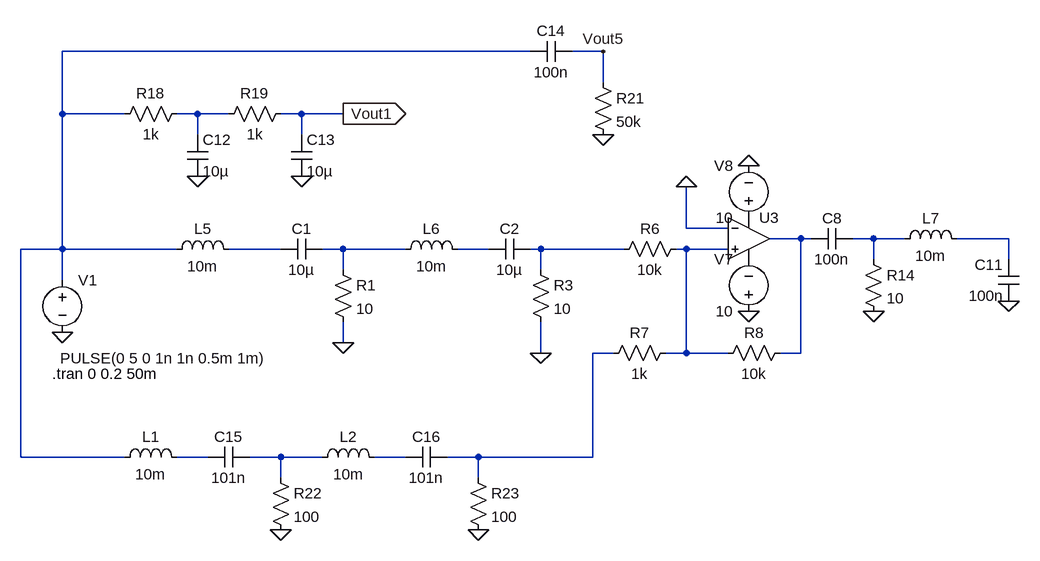
[diagram p0: schematic Project.asc]
Project.asc, the LTspice schematic file:
Version 4
SHEET 1 2452 680
WIRE -416 -272 -1136 -272
WIRE -304 -272 -352 -272
WIRE -304 -224 -304 -272
WIRE -1136 -176 -1136 -272
WIRE -1040 -176 -1136 -176
WIRE -928 -176 -960 -176
WIRE -880 -176 -928 -176
WIRE -768 -176 -800 -176
WIRE -704 -176 -768 -176
WIRE -928 -144 -928 -176
WIRE -768 -144 -768 -176
WIRE -176 0 -176 -64
WIRE -112 0 -176 0
WIRE 0 16 -48 16
WIRE 16 16 0 16
WIRE 112 16 80 16
WIRE 160 16 112 16
WIRE 320 16 240 16
WIRE -1136 32 -1136 -176
WIRE -1136 32 -1200 32
WIRE -960 32 -1136 32
WIRE -800 32 -880 32
WIRE -704 32 -736 32
WIRE -608 32 -704 32
WIRE -480 32 -528 32
WIRE -400 32 -416 32
WIRE -272 32 -400 32
WIRE -176 32 -192 32
WIRE -112 32 -176 32
WIRE 112 48 112 16
WIRE 320 48 320 16
WIRE -704 64 -704 32
WIRE -400 64 -400 32
WIRE -1136 80 -1136 32
WIRE -704 176 -704 144
WIRE -400 192 -400 144
WIRE -288 192 -320 192
WIRE -176 192 -176 32
WIRE -176 192 -208 192
WIRE -112 192 -176 192
WIRE 0 192 0 16
WIRE 0 192 -32 192
WIRE -1200 352 -1200 32
WIRE -1040 352 -1200 352
WIRE -912 352 -960 352
WIRE -800 352 -848 352
WIRE -736 352 -800 352
WIRE -608 352 -656 352
WIRE -496 352 -544 352
WIRE -320 352 -320 192
WIRE -320 352 -496 352
WIRE -800 384 -800 352
WIRE -496 384 -496 352
FLAG -1136 160 0
FLAG -176 -64 0
FLAG -80 -96 0
FLAG -80 128 0
FLAG 112 128 0
FLAG -928 -80 0
FLAG -768 -80 0
FLAG -304 -144 0
FLAG -304 -272 Vout5
FLAG -800 464 0
FLAG -496 464 0
FLAG -704 -176 Vout1
IOPIN -704 -176 Out
FLAG -704 176 0
FLAG -400 192 0
FLAG 320 112 0
SYMBOL voltage -1136 64 R0
WINDOW 3 -3 136 Left 2
WINDOW 123 0 0 Left 0
WINDOW 39 0 0 Left 0
SYMATTR Value PULSE(0 5 0 1n 1n 0.5m 1m)
SYMATTR InstName V1
SYMBOL OpAmps\\UniversalOpAmp2 -80 16 R0
SYMATTR InstName U3
SYMBOL res -176 16 R90
WINDOW 0 0 56 VBottom 2
WINDOW 3 32 56 VTop 2
SYMATTR InstName R6
SYMATTR Value 10k
SYMBOL res -304 208 R270
WINDOW 0 32 56 VTop 2
WINDOW 3 0 56 VBottom 2
SYMATTR InstName R7
SYMATTR Value 1k
SYMBOL res -16 176 R90
WINDOW 0 0 56 VBottom 2
WINDOW 3 32 56 VTop 2
SYMATTR InstName R8
SYMATTR Value 10k
SYMBOL voltage -80 144 R180
WINDOW 0 24 96 Left 2
WINDOW 3 24 16 Left 2
SYMATTR InstName V7
SYMATTR Value 10
SYMBOL voltage -80 0 R180
WINDOW 0 24 96 Left 2
WINDOW 3 24 16 Left 2
SYMATTR InstName V8
SYMATTR Value 10
SYMBOL cap 80 0 R90
WINDOW 0 0 32 VBottom 2
WINDOW 3 32 32 VTop 2
SYMATTR InstName C8
SYMATTR Value 100n
SYMBOL res 96 32 R0
SYMATTR InstName R14
SYMATTR Value 10
SYMBOL cap 336 112 R180
WINDOW 0 24 56 Left 2
WINDOW 3 24 8 Left 2
SYMATTR InstName C11
SYMATTR Value 100n
SYMBOL res -944 -192 R90
WINDOW 0 0 56 VBottom 2
WINDOW 3 32 56 VTop 2
SYMATTR InstName R18
SYMATTR Value 1k
SYMBOL res -784 -192 R90
WINDOW 0 0 56 VBottom 2
WINDOW 3 32 56 VTop 2
SYMATTR InstName R19
SYMATTR Value 1k
SYMBOL cap -944 -144 R0
SYMATTR InstName C12
SYMATTR Value 10µ
SYMBOL cap -784 -144 R0
SYMATTR InstName C13
SYMATTR Value 10µ
SYMBOL res -320 -240 R0
SYMATTR InstName R21
SYMATTR Value 50k
SYMBOL cap -352 -288 R90
WINDOW 0 0 32 VBottom 2
WINDOW 3 32 32 VTop 2
SYMATTR InstName C14
SYMATTR Value 100n
SYMBOL ind -1056 368 R270
WINDOW 0 32 56 VTop 2
WINDOW 3 5 56 VBottom 2
SYMATTR InstName L1
SYMATTR Value 10m
SYMBOL cap -848 336 R90
WINDOW 0 0 32 VBottom 2
WINDOW 3 32 32 VTop 2
SYMATTR InstName C15
SYMATTR Value 101n
SYMBOL res -816 368 R0
SYMATTR InstName R22
SYMATTR Value 100
SYMBOL ind -752 368 R270
WINDOW 0 32 56 VTop 2
WINDOW 3 5 56 VBottom 2
SYMATTR InstName L2
SYMATTR Value 10m
SYMBOL cap -544 336 R90
WINDOW 0 0 32 VBottom 2
WINDOW 3 32 32 VTop 2
SYMATTR InstName C16
SYMATTR Value 101n
SYMBOL res -512 368 R0
SYMATTR InstName R23
SYMATTR Value 100
SYMBOL ind -976 48 R270
WINDOW 0 32 56 VTop 2
WINDOW 3 5 56 VBottom 2
SYMATTR InstName L5
SYMATTR Value 10m
SYMBOL cap -736 16 R90
WINDOW 0 0 32 VBottom 2
WINDOW 3 32 32 VTop 2
SYMATTR InstName C1
SYMATTR Value 10µ
SYMBOL ind -624 48 R270
WINDOW 0 32 56 VTop 2
WINDOW 3 5 56 VBottom 2
SYMATTR InstName L6
SYMATTR Value 10m
SYMBOL res -720 48 R0
SYMATTR InstName R1
SYMATTR Value 10
SYMBOL cap -416 16 R90
WINDOW 0 0 32 VBottom 2
WINDOW 3 32 32 VTop 2
SYMATTR InstName C2
SYMATTR Value 10µ
SYMBOL ind 144 32 R270
WINDOW 0 32 56 VTop 2
WINDOW 3 5 56 VBottom 2
SYMATTR InstName L7
SYMATTR Value 10m
SYMBOL res -416 48 R0
SYMATTR InstName R3
SYMATTR Value 10
TEXT -1152 224 Left 2 !.tran 0 0.2 50m

The netlist it stands for:
* Project.asc
V1 N001 0 PULSE(0 5 0 1n 1n 0.5m 1m)
XU3 N010 0 P001 P002 N003 level2 Avol=1Meg GBW=10Meg Slew=10Meg Ilimit=25m Rail=0 Vos=0 En=0 Enk=0 In=0 Ink=0 Rin=500Meg  ; pins In+ In- V+ V- OUT
R6 N010 N009 10k
R7 N011 N010 1k
R8 N003 N010 10k
V7 0 P002 10
V8 P001 0 10
C8 N004 N003 100n
R14 N004 0 10
C11 0 N005 100n
R18 N002 N001 1k
R19 Vout1 N002 1k
C12 N002 0 10µ
C13 Vout1 0 10µ
R21 Vout5 0 50k
C14 Vout5 N001 100n
L1 N001 N012 10m
C15 N013 N012 101n
R22 N013 0 100
L2 N013 N014 10m
C16 N011 N014 101n
R23 N011 0 100
L5 N001 N006 10m
C1 N007 N006 10µ
L6 N007 N008 10m
R1 N007 0 10
C2 N009 N008 10µ
L7 N004 N005 10m
R3 N009 0 10
.tran 0 0.2 50m
.lib UniversalOpAmp2.lib
.backanno
.end